# Altium schematic sheet Boost.SchDoc
size A
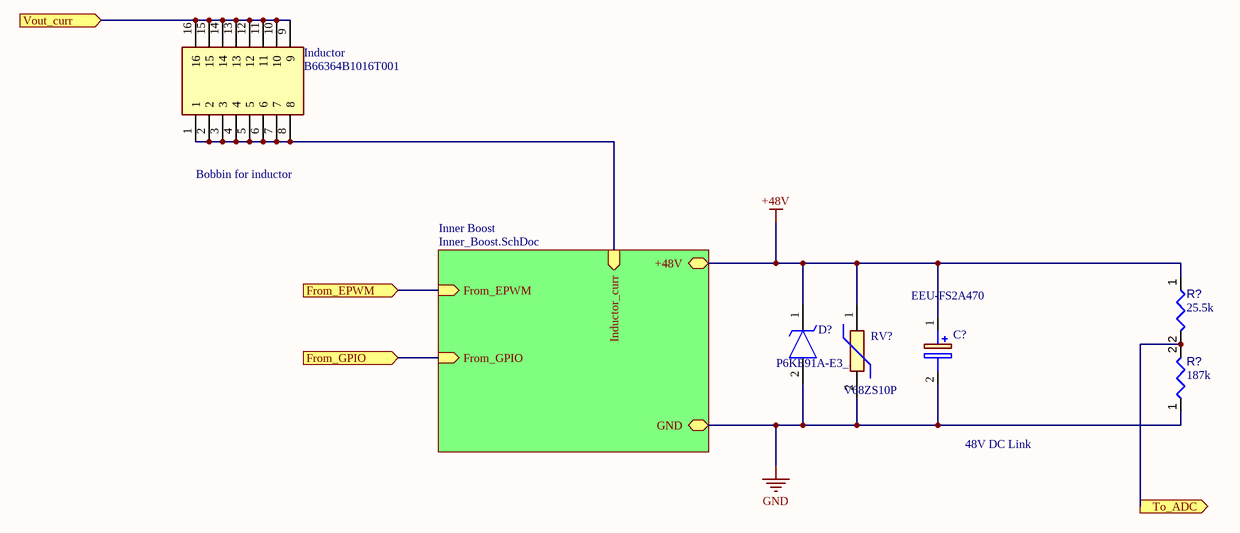
[diagram p0: Boost.SchDoc]

## Parts
(Parts that share a designator on the sheet are numbered #1, #2 ... from top to bottom, then left to right.)
C?  EEU-FS2A470  [CAPPRD350W65D800H1650]
D?  P6KE91A-E3_54  [DIOAD1910W86L670D310]
Inductor  B66364B1016T001  [B66364B1016T001]
R?#1  value 25.5k  [RESC0402(1005)_L]  (hidden comment: Resistor 25K5 +/-1 % 0402 63 mW)
R?#2  value 187k  [RESC0402(1005)_L]  (hidden comment: Resistor 187K +/-1 % 0402 63 mW)
RV?  V68ZS10P  [V68ZS10P]

## Sub-sheets
Inner Boost = Inner_Boost.SchDoc: From_EPWM (in), From_GPIO (in), Inductor_curr (in), GND (bidir), +48V (bidir)

## Ports
From_EPWM (in), From_GPIO (in), To_ADC (out), Vout_curr (in)

## Nets
+48V: C?.1(+) D?.1(K) R?#1.1 RV?.1 ; sheet Inner Boost/+48V
GND: C?.2(-) D?.2(A) R?#2.1 RV?.2 ; sheet Inner Boost/GND
From_EPWM: port From_EPWM, sheet Inner Boost/From_EPWM
From_GPIO: port From_GPIO, sheet Inner Boost/From_GPIO
To_ADC: R?#1.2 R?#2.2 ; port To_ADC
Vout_curr: Inductor.9 Inductor.10 Inductor.11 Inductor.12 Inductor.13 Inductor.14 Inductor.15 Inductor.16 ; port Vout_curr
NetInductor_1: Inductor.1 Inductor.2 Inductor.3 Inductor.4 Inductor.5 Inductor.6 Inductor.7 Inductor.8 ; sheet Inner Boost/Inductor_curr

## Notes on the sheet
- Bobbin for inductor
- 48V DC Link

## Library data of the parts
C? = EEU-FS2A470: Capacitor Polarised; Manufacturer_Name: Panasonic; Datasheet Link: https://componentsearchengine.com/Datasheets/1/EEU-FS2A470.pdf; Height: 16.5mm; Manufacturer_Part_Number: EEU-FS2A470; Mouser Part Number: 667-EEU-FS2A470; Mouser Price/Stock: https://www.mouser.co.uk/ProductDetail/Panasonic/EEU-FS2A470?qs=w%2Fv1CP2dgqrDlaRaE647gA%3D%3D; Arrow Part Number: EEU-FS2A470; Arrow Price/Stock: https://www.arrow.com/en/products/eeu-fs2a470/panasonic
D? = P6KE91A-E3_54: TVS Diode (Uni-directional); Manufacturer_Name: Vishay; Manufacturer_Part_Number: P6KE91A-E3/54; Datasheet Link: https://www.mouser.com/datasheet/2/427/p6ke-1767850.pdf
Inductor = B66364B1016T001: Undefined or Miscellaneous; Manufacturer_Name: TDK; Datasheet Link: https://www.mouser.com/datasheet/2/400/etd_39_20_13-1527806.pdf; Height: 35.5mm; Manufacturer_Part_Number: B66364B1016T001; Mouser Part Number: 871-B66364B1016T001; Mouser Price/Stock: https://www.mouser.co.uk/ProductDetail/EPCOS-TDK/B66364B1016T001/?qs=w5o0Loj0u7OCD3bXX%252BmaPQ%3D%3D; Arrow Part Number: B66364B1016T001; Arrow Price/Stock: https://www.arrow.com/en/products/b66364b1016t001/epcos-tdk
R?#1 = CMP-009-00171-3: Chip Resistor, 25,5 kOhms, +/-1 %, 63 mW, -55 to 155 degC, 0402; Tolerance: 1%; Power: 63mW; Case/Package: 0402; Min Operating Temperature: -55°C; Max Operating Temperature: 155°C; Pins: 2
R?#2 = CMP-009-00170-3: Chip Resistor, 187 kOhms, +/-1 %, 63 mW, -55 to 155 degC, 0402; Power: 63mW; Tolerance: 1%; Case/Package: 0402; Min Operating Temperature: -55°C; Pins: 2; Max Operating Temperature: 155°C
RV? = V68ZS10P: Varistor; Manufacturer_Name: LITTELFUSE; Datasheet Link: http://www.littelfuse.com/~/media/electronics/datasheets/varistors/littelfuse_varistor_za_datasheet.pdf.pdf; Height: 20mm; Manufacturer_Part_Number: V68ZS10P; Mouser Part Number: 576-V68ZS10P; Mouser Price/Stock: https://www.mouser.co.uk/ProductDetail/Littelfuse/V68ZS10P?qs=1%2FWRN91BpNvIRlTsONWDiQ%3D%3D